# EAGLE design PARKPCB (EAGLE 9.3.0)
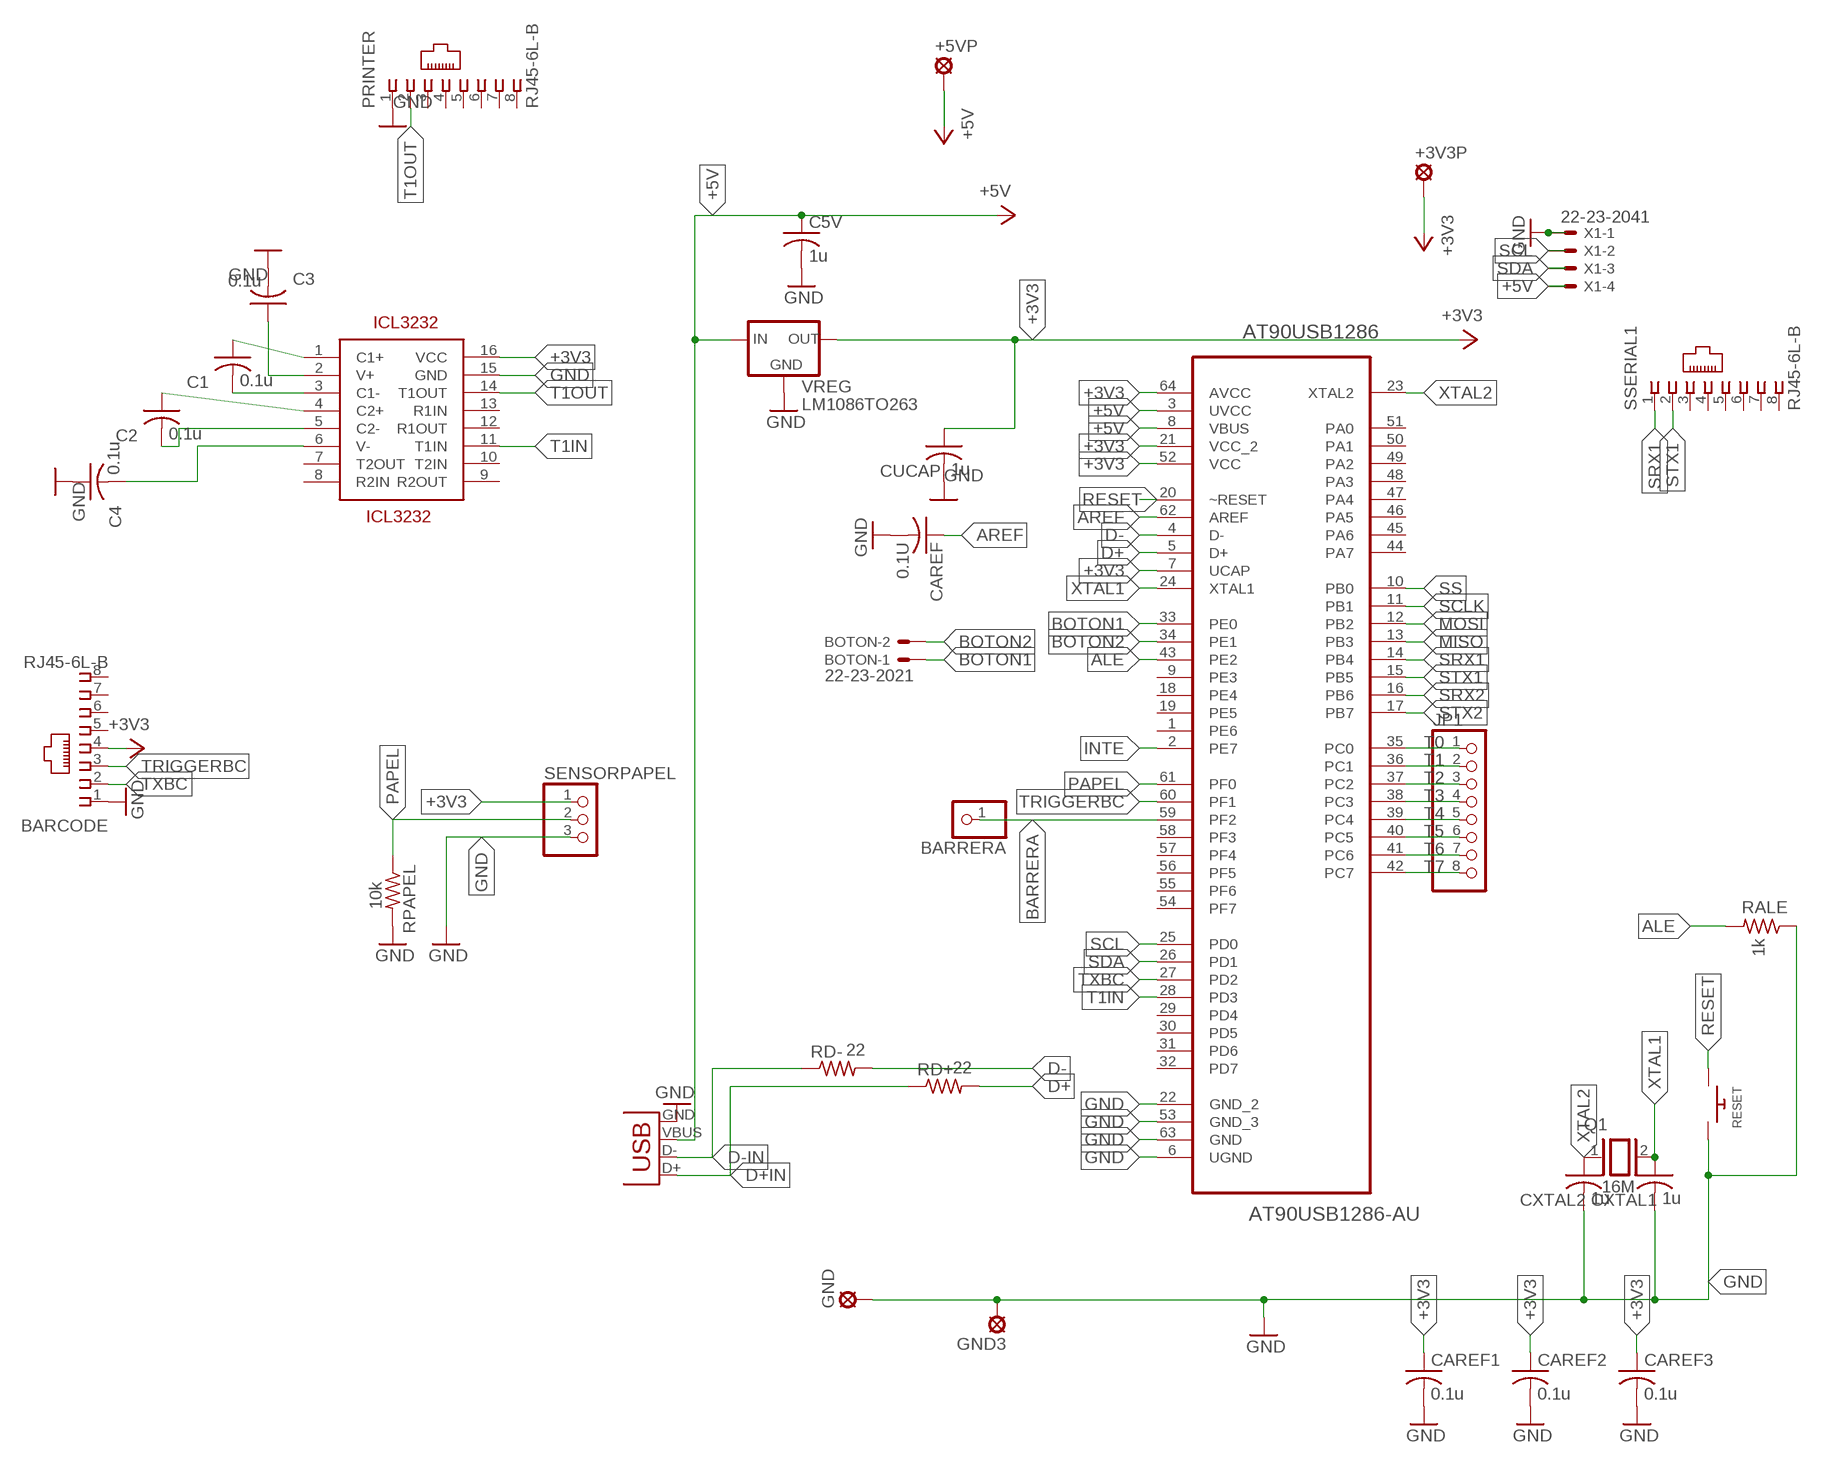
[diagram p0: schematic, sheet 1, part 1 of 2]
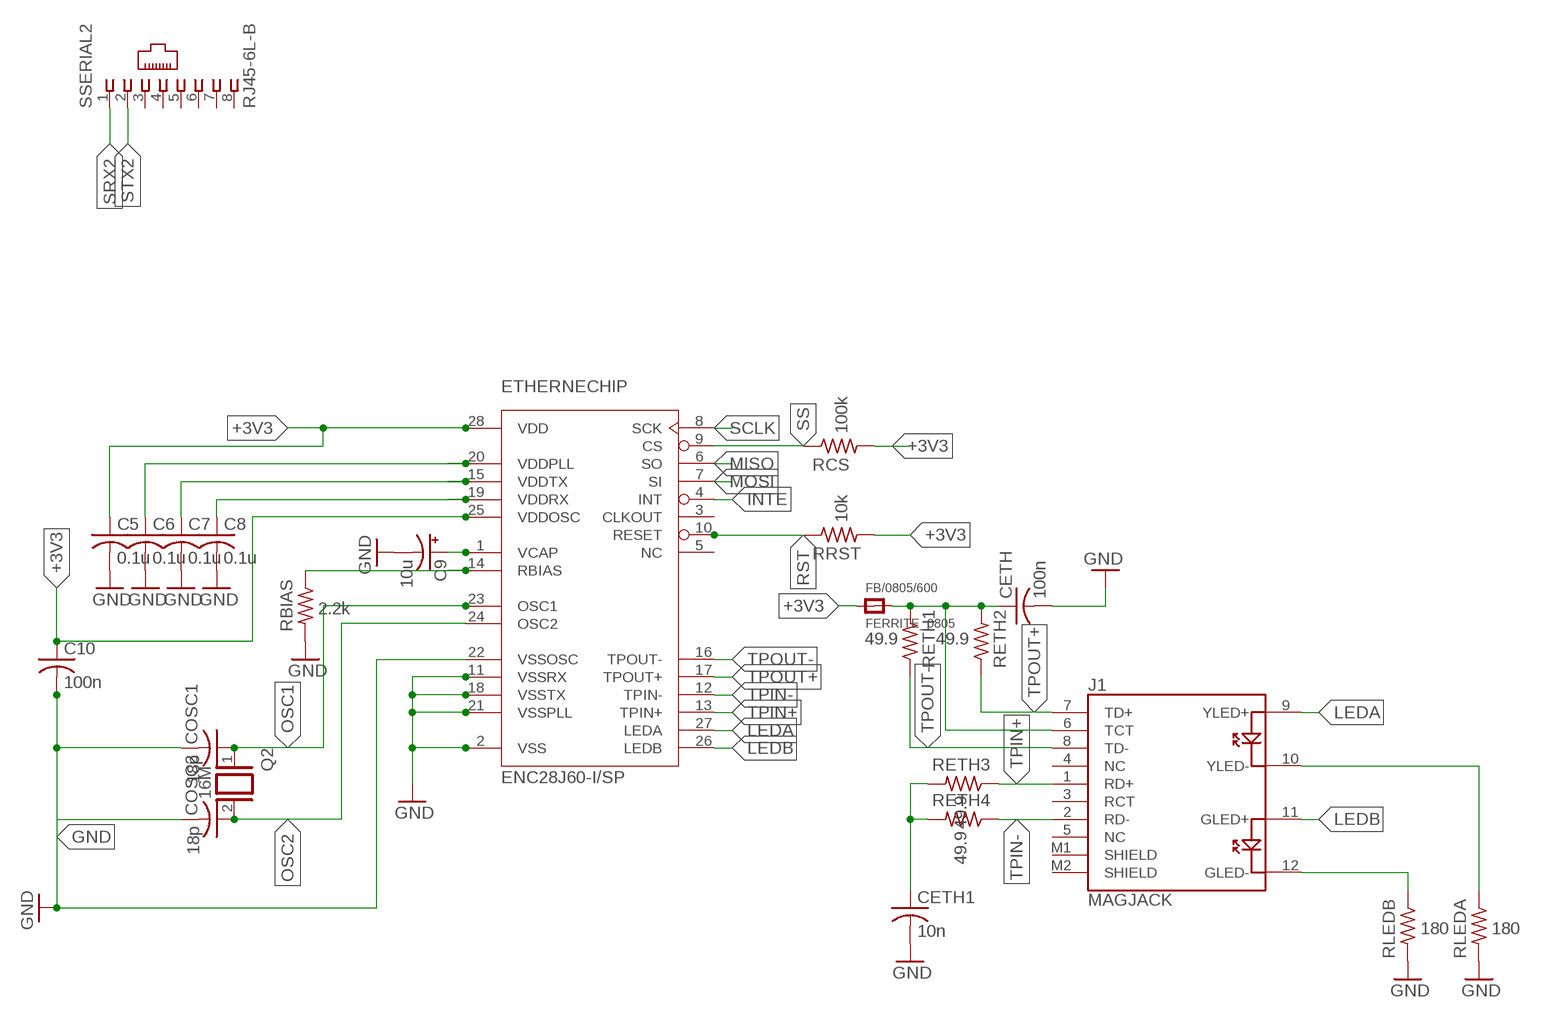
[diagram p1: schematic, sheet 1, part 2 of 2]

## Parts
+3V3P  LSP10  [LSP10]
+5VP  LSP10  [LSP10]
AT90USB1286  AT90USB1286-AU  [QFP80P1600X1600X120-64N]
BARCODE  RJ45-6L-B  [RJ45-NO-SHIELD]
BARRERA  PINHD-1X1  [1X01]
BOTON  22-23-2021  [22-23-2021]
C1  0.1u  C-US050-030X075  [C050-030X075]
C2  0.1u  C-US050-030X075  [C050-030X075]
C3  0.1u  C-US050-030X075  [C050-030X075]
C4  0.1u  C-US050-030X075  [C050-030X075]
C5  0.1u  C-US050-030X075  [C050-030X075]
C5V  1u  C-US050-030X075  [C050-030X075]
C6  0.1u  C-US050-030X075  [C050-030X075]
C7  0.1u  C-US050-030X075  [C050-030X075]
C8  0.1u  C-US050-030X075  [C050-030X075]
C9  10u  CPOL-USB45181B  [B45181B]
C10  100n  C-US050-030X075  [C050-030X075]
CAREF  0.1U  C-US050-030X075  [C050-030X075]
CAREF1  0.1u  C-US050-030X075  [C050-030X075]
CAREF2  0.1u  C-US050-030X075  [C050-030X075]
CAREF3  0.1u  C-US050-030X075  [C050-030X075]
CETH  100n  C-US050-030X075  [C050-030X075]
CETH1  10n  C-US050-030X075  [C050-030X075]
COSC1  18p  C-US050-030X075  [C050-030X075]
COSC2  18p  C-US050-030X075  [C050-030X075]
CUCAP  1u  C-US050-030X075  [C050-030X075]
CXTAL1  1u  C-US050-030X075  [C050-030X075]
CXTAL2  1u  C-US050-030X075  [C050-030X075]
ETHERNECHIP  ENC28J60-I/SP  [DIP28]
FB/0805/600  FERRITE_0805  [_0805]
GND  LSP10  [LSP10]
GND3  LSP10  [LSP10]
ICL3232  ICL3232  [DIL16]
J1  MAGJACK  [MAGJACK]
JP1  PINHD-1X8BIG  [1X08-BIG]
PRINTER  RJ45-6L-B  [RJ45-NO-SHIELD]
Q1  16M  XTAL/S  [QS]
Q2  16M  XTAL/S  [QS]
RALE  1k  R-US_0309/12  [0309/12]
RBIAS  2.2k  R-US_0309/12  [0309/12]
RCS  100k  R-US_0309/12  [0309/12]
RD+  22  R-US_0309/12  [0309/12]
RD-  22  R-US_0309/12  [0309/12]
RESET  SWITCH_PUSHBUTTONC&K_KSS  [BTN_CK_KSS]
RETH1  49.9  R-US_0309/12  [0309/12]
RETH2  49.9  R-US_0309/12  [0309/12]
RETH3  49.9  R-US_0309/12  [0309/12]
RETH4  49.9  R-US_0309/12  [0309/12]
RLEDA  180  R-US_0309/12  [0309/12]
RLEDB  180  R-US_0309/12  [0309/12]
RPAPEL  10k  R-US_0309/12  [0309/12]
RRST  10k  R-US_0309/12  [0309/12]
SENSORPAPEL  PINHD-1X3  [1X03]
SSERIAL1  RJ45-6L-B  [RJ45-NO-SHIELD]
SSERIAL2  RJ45-6L-B  [RJ45-NO-SHIELD]
USB  USB-MB-S  [USB-MB-S]
VREG  LM1086TO263  [TO263]
X1  22-23-2041  [22-23-2041]

## Nets
+3V3: +3V3P.MP AT90USB1286.7(UCAP) AT90USB1286.21(VCC_2) AT90USB1286.52(VCC) AT90USB1286.64(AVCC) BARCODE.4 C5.1 C10.1 CAREF1.1 CAREF2.1 CAREF3.1 CUCAP.1 ETHERNECHIP.25(VDDOSC) ETHERNECHIP.28(VDD) FB/0805/600.1 ICL3232.16(VCC) RCS.2 RRST.2 SENSORPAPEL.1 VREG.2(OUT)
+5V: +5VP.MP AT90USB1286.3(UVCC) AT90USB1286.8(VBUS) C5V.1 USB.VBUS VREG.3(IN) X1.4
ALE: AT90USB1286.43(PE2) RALE.2
AREF: AT90USB1286.62(AREF) CAREF.1
BARRERA: AT90USB1286.59(PF2) BARRERA.1
BOTON1: AT90USB1286.33(PE0) BOTON.1
BOTON2: AT90USB1286.34(PE1) BOTON.2
D+: AT90USB1286.5(D+) RD+.2
D+IN: RD+.1 USB.D+
D-: AT90USB1286.4(D-) RD-.2
D-IN: RD-.1 USB.D-
GND: AT90USB1286.6(UGND) AT90USB1286.22(GND_2) AT90USB1286.53(GND_3) AT90USB1286.63(GND) BARCODE.1 C3.2 C4.1 C5.2 C5V.2 C6.2 C7.2 C8.2 C9.- C10.2 CAREF1.2 CAREF2.2 CAREF3.2 CAREF.2 CETH1.2 CETH.2 COSC1.2 COSC2.2 CUCAP.2 CXTAL1.2 CXTAL2.2 ETHERNECHIP.2(VSS) ETHERNECHIP.11(VSSRX) ETHERNECHIP.18(VSSTX) ETHERNECHIP.21(VSSPLL) ETHERNECHIP.22(VSSOSC) GND3.MP GND.MP ICL3232.15(GND) PRINTER.1 RALE.1 RBIAS.2 RESET.P$2 RLEDA.2 RLEDB.2 RPAPEL.2 SENSORPAPEL.3 USB.GND VREG.1(GND) X1.1
INTE: AT90USB1286.2(PE7) ETHERNECHIP.4(INT)
LEDA: ETHERNECHIP.27(LEDA) J1.9(YLED+)
LEDB: ETHERNECHIP.26(LEDB) J1.11(GLED+)
MISO: AT90USB1286.13(PB3) ETHERNECHIP.6(SO)
MOSI: AT90USB1286.12(PB2) ETHERNECHIP.7(SI)
N$1: CETH.1 FB/0805/600.2 J1.6(TCT) RETH1.2 RETH2.2
N$2: C6.1 ETHERNECHIP.20(VDDPLL)
N$3: C7.1 ETHERNECHIP.15(VDDTX)
N$4: C8.1 ETHERNECHIP.19(VDDRX)
N$5: CETH1.1 RETH3.2 RETH4.2
N$6: C9.+ ETHERNECHIP.1(VCAP)
N$7: ETHERNECHIP.14(RBIAS) RBIAS.1
N$14: J1.12(GLED-) RLEDB.1
N$15: J1.10(YLED-) RLEDA.1
N$20: C1.1 ICL3232.1(C1+)
N$21: C3.1 ICL3232.2(V+)
N$22: C1.2 ICL3232.3(C1-)
N$23: C2.1 ICL3232.4(C2+)
N$24: C2.2 ICL3232.5(C2-)
N$25: C4.2 ICL3232.6(V-)
OSC1: COSC1.1 ETHERNECHIP.23(OSC1) Q2.1
OSC2: COSC2.1 ETHERNECHIP.24(OSC2) Q2.2
PAPEL: AT90USB1286.61(PF0) RPAPEL.1 SENSORPAPEL.2
RESET: AT90USB1286.20(~RESET) RESET.P$1
RST: ETHERNECHIP.10(RESET) RRST.1
SCL: AT90USB1286.25(PD0) X1.2
SCLK: AT90USB1286.11(PB1) ETHERNECHIP.8(SCK)
SDA: AT90USB1286.26(PD1) X1.3
SRX1: AT90USB1286.14(PB4) SSERIAL1.1
SRX2: AT90USB1286.16(PB6) SSERIAL2.1
SS: AT90USB1286.10(PB0) ETHERNECHIP.9(CS) RCS.1
STX1: AT90USB1286.15(PB5) SSERIAL1.2
STX2: AT90USB1286.17(PB7) SSERIAL2.2
T0: AT90USB1286.35(PC0) JP1.1
T1: AT90USB1286.36(PC1) JP1.2
T1IN: AT90USB1286.28(PD3) ICL3232.11(T1IN)
T1OUT: ICL3232.14(T1OUT) PRINTER.2
T2: AT90USB1286.37(PC2) JP1.3
T3: AT90USB1286.38(PC3) JP1.4
T4: AT90USB1286.39(PC4) JP1.5
T5: AT90USB1286.40(PC5) JP1.6
T6: AT90USB1286.41(PC6) JP1.7
T7: AT90USB1286.42(PC7) JP1.8
TPIN+: ETHERNECHIP.13(TPIN+) J1.1(RD+) RETH3.1
TPIN-: ETHERNECHIP.12(TPIN-) J1.2(RD-) RETH4.1
TPOUT+: ETHERNECHIP.17(TPOUT+) J1.7(TD+) RETH2.1
TPOUT-: ETHERNECHIP.16(TPOUT-) J1.8(TD-) RETH1.1
TRIGGERBC: AT90USB1286.60(PF1) BARCODE.3
TXBC: AT90USB1286.27(PD2) BARCODE.2
XTAL1: AT90USB1286.24(XTAL1) CXTAL1.1 Q1.2
XTAL2: AT90USB1286.23(XTAL2) CXTAL2.1 Q1.1
Unconnected: AT90USB1286.1(PE6) AT90USB1286.9(PE3) AT90USB1286.18(PE4) AT90USB1286.19(PE5) AT90USB1286.29(PD4) AT90USB1286.30(PD5) AT90USB1286.31(PD6) AT90USB1286.32(PD7) AT90USB1286.44(PA7) AT90USB1286.45(PA6) AT90USB1286.46(PA5) AT90USB1286.47(PA4) AT90USB1286.48(PA3) AT90USB1286.49(PA2) AT90USB1286.50(PA1) AT90USB1286.51(PA0) AT90USB1286.54(PF7) AT90USB1286.55(PF6) AT90USB1286.56(PF5) AT90USB1286.57(PF4) AT90USB1286.58(PF3) BARCODE.5 BARCODE.6 BARCODE.7 BARCODE.8 ETHERNECHIP.3(CLKOUT) ETHERNECHIP.5(NC) ICL3232.7(T2OUT) ICL3232.8(R2IN) ICL3232.9(R2OUT) ICL3232.10(T2IN) ICL3232.12(R1OUT) ICL3232.13(R1IN) J1.3(RCT) J1.4(NC) J1.5(NC) J1.M1(SHIELD) J1.M2(SHIELD) PRINTER.3 PRINTER.4 PRINTER.5 PRINTER.6 PRINTER.7 PRINTER.8 SSERIAL1.3 SSERIAL1.4 SSERIAL1.5 SSERIAL1.6 SSERIAL1.7 SSERIAL1.8 SSERIAL2.3 SSERIAL2.4 SSERIAL2.5 SSERIAL2.6 SSERIAL2.7 SSERIAL2.8

## Library data of the parts
+3V3P +5VP GND GND3 = solpad:LSP10: SOLDER PAD drill 1.0 mm, distributor Buerklin, 12H555
AT90USB1286 = Atmel_By_element14_Batch_1-00:AT90USB1286-AU: MCU; DESCRIPTION: MCU; MPN: AT90USB1286-AU; OC_FARNELL: 1748495; OC_NEWARK: 26R5675; PACKAGE: QFP-64; SUPPLIER: Atmel
BARCODE PRINTER SSERIAL1 SSERIAL2 = con-tycoelectronics:RJ45: CORCOM Modular RJ Jacks No Shield Source: www.tycoelectronics.com .. ENG_DS_1654001_1099_RJ_L_0507.pdf; MPN: RJ45-6L-B; OC_FARNELL: unknown; OC_NEWARK: 16R6090
BARRERA = adafruit:PINHD-1X1: Pin header 1x1 for 0.1" spacing With round pins
BOTON = con-molex:22-23-2021: .100" (2.54mm) Center Header - 2 Pin; MF: MOLEX; MPN: 22-23-2021; OC_FARNELL: 1462926; OC_NEWARK: 25C3832
C1-C5 C5V C6-C8 C10 CAREF CAREF1-CAREF3 CETH CETH1 COSC1 COSC2 CUCAP CXTAL1 CXTAL2 = rcl:C-US: CAPACITOR, American symbol; SPICEPREFIX: C
C9 = rcl:CPOL-US: POLARIZED CAPACITOR, American symbol; SPICEPREFIX: C
ETHERNECHIP = microchip-ethernet:ENC28J60: Stand-Alone 10 Ethernet Controller with SPI interface The ENC28J60 is a stand-alone Ethernet controller with an industry standard Serial Peripheral Interface (SPI). It is designed to serve as an Ethernet network interface for any controller equipped with SPI. The ENC28J60 meets all of the IEEE 802.3 specifications. It incorporates a number of packet filtering schemes to limit incoming packets. It also provides an internal DMA module for fast data throughput and hardware assisted checksum calculation, which is used in various network protocols. Communication with the host controller is implemented via an interrupt pin and the SPI, with clock rates of up to 20 MHz. Two dedicated pins are used for LED link and network activity indication.
FB/0805/600 = audio amplifier example:FERRITE
ICL3232 = ICL3232:ICL3232: 3V to RS-232 transceiver; AVAILABILITY: Unavailable; MF: Intersil; MP: ICL3232; PACKAGE: None; PRICE: None
J1 = SparkFun-Connectors:MAGJACK: MAGJACK: RJ-45 with LEDs This is a single port, RJ45 ethernet jacks with built in transformer (magnetics), status LEDs, and shielding. Here is the connector we sell at SparkFun: RJ45 Ethernet MagJack-Compatible <https://www.sparkfun.com/products/8534> (PRT-08534) Datasheet <http://www.sparkfun.com/datasheets/Prototyping/MagJack.pdf> It is used on this SparkFun product: SparkFun RJ45 MagJack Breakout <https://www.sparkfun.com/products/13021> (BOB-13021); PROD_ID: CONN-09556; SF_ID: PRT-08534
JP1 = adafruit:PINHD-1X8: PIN HEADER
Q1 Q2 = special:XTAL/S: CRYSTAL
RALE RBIAS RCS RD+ RD- RETH1-RETH4 RLEDA RLEDB RPAPEL RRST = rcl:R-US_: RESISTOR, American symbol; SPICEPREFIX: R
RESET = adafruit:SWITCH_PUSHBUTTON: Buttons SOFTTOUCHSMD_SJ - Soft touch temporary push button (Super Junk Akihabara) Compatible with SKPMANE010 [Mouser: 688-SKPMAN] C&K_KSS = Digikey: KSS221GLFS
SENSORPAPEL = adafruit:PINHD-1X3: PIN HEADER
USB = con-usb:USB: USB Connectors
VREG = v-reg-2:LM1086
X1 = con-molex:22-23-2041: .100" (2.54mm) Center Header - 4 Pin; MF: MOLEX; MPN: 22-23-2041; OC_FARNELL: 1462920; OC_NEWARK: 38C0355

## Board
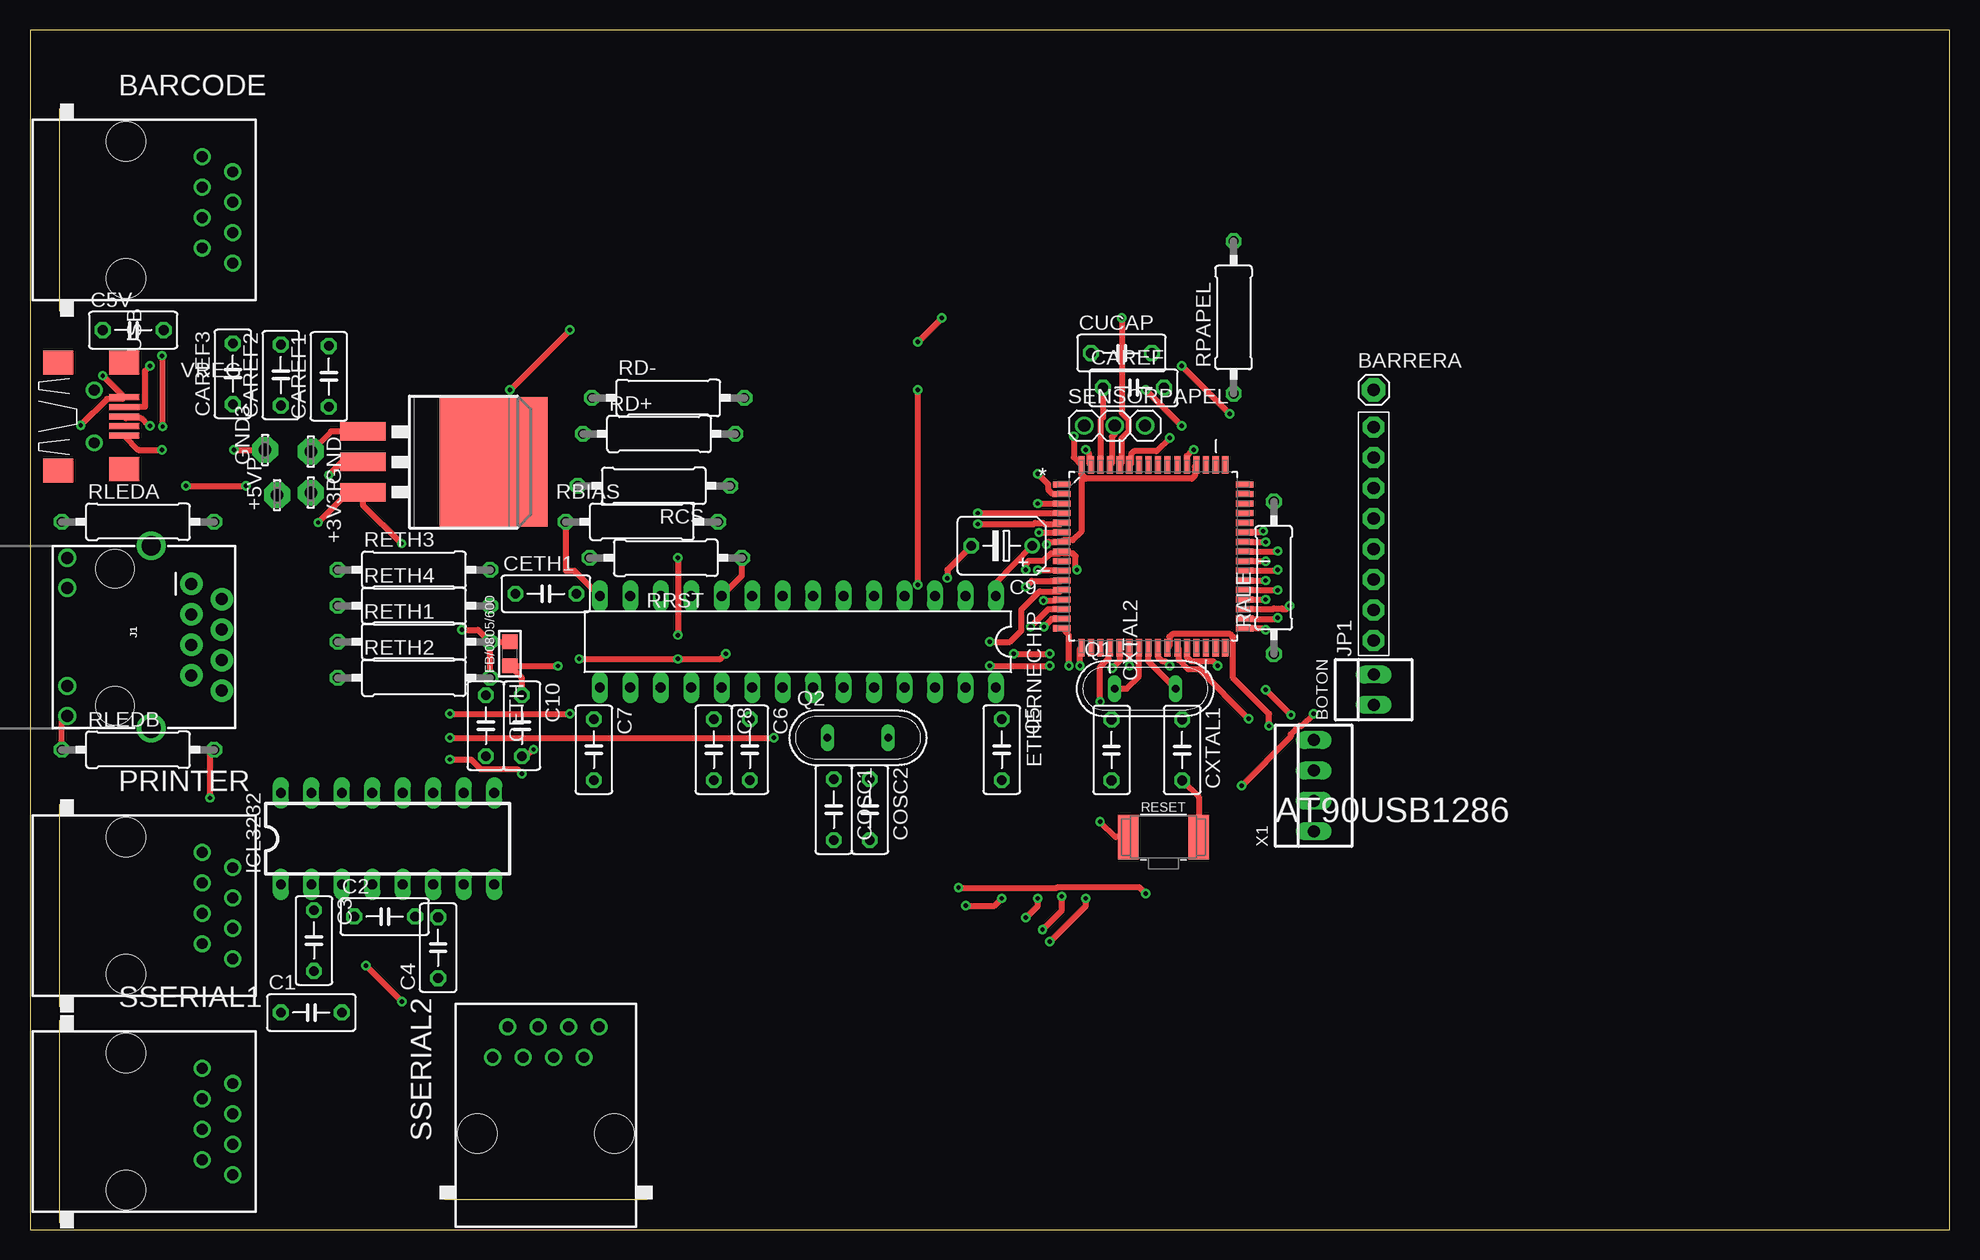
[diagram p2: board, top side]
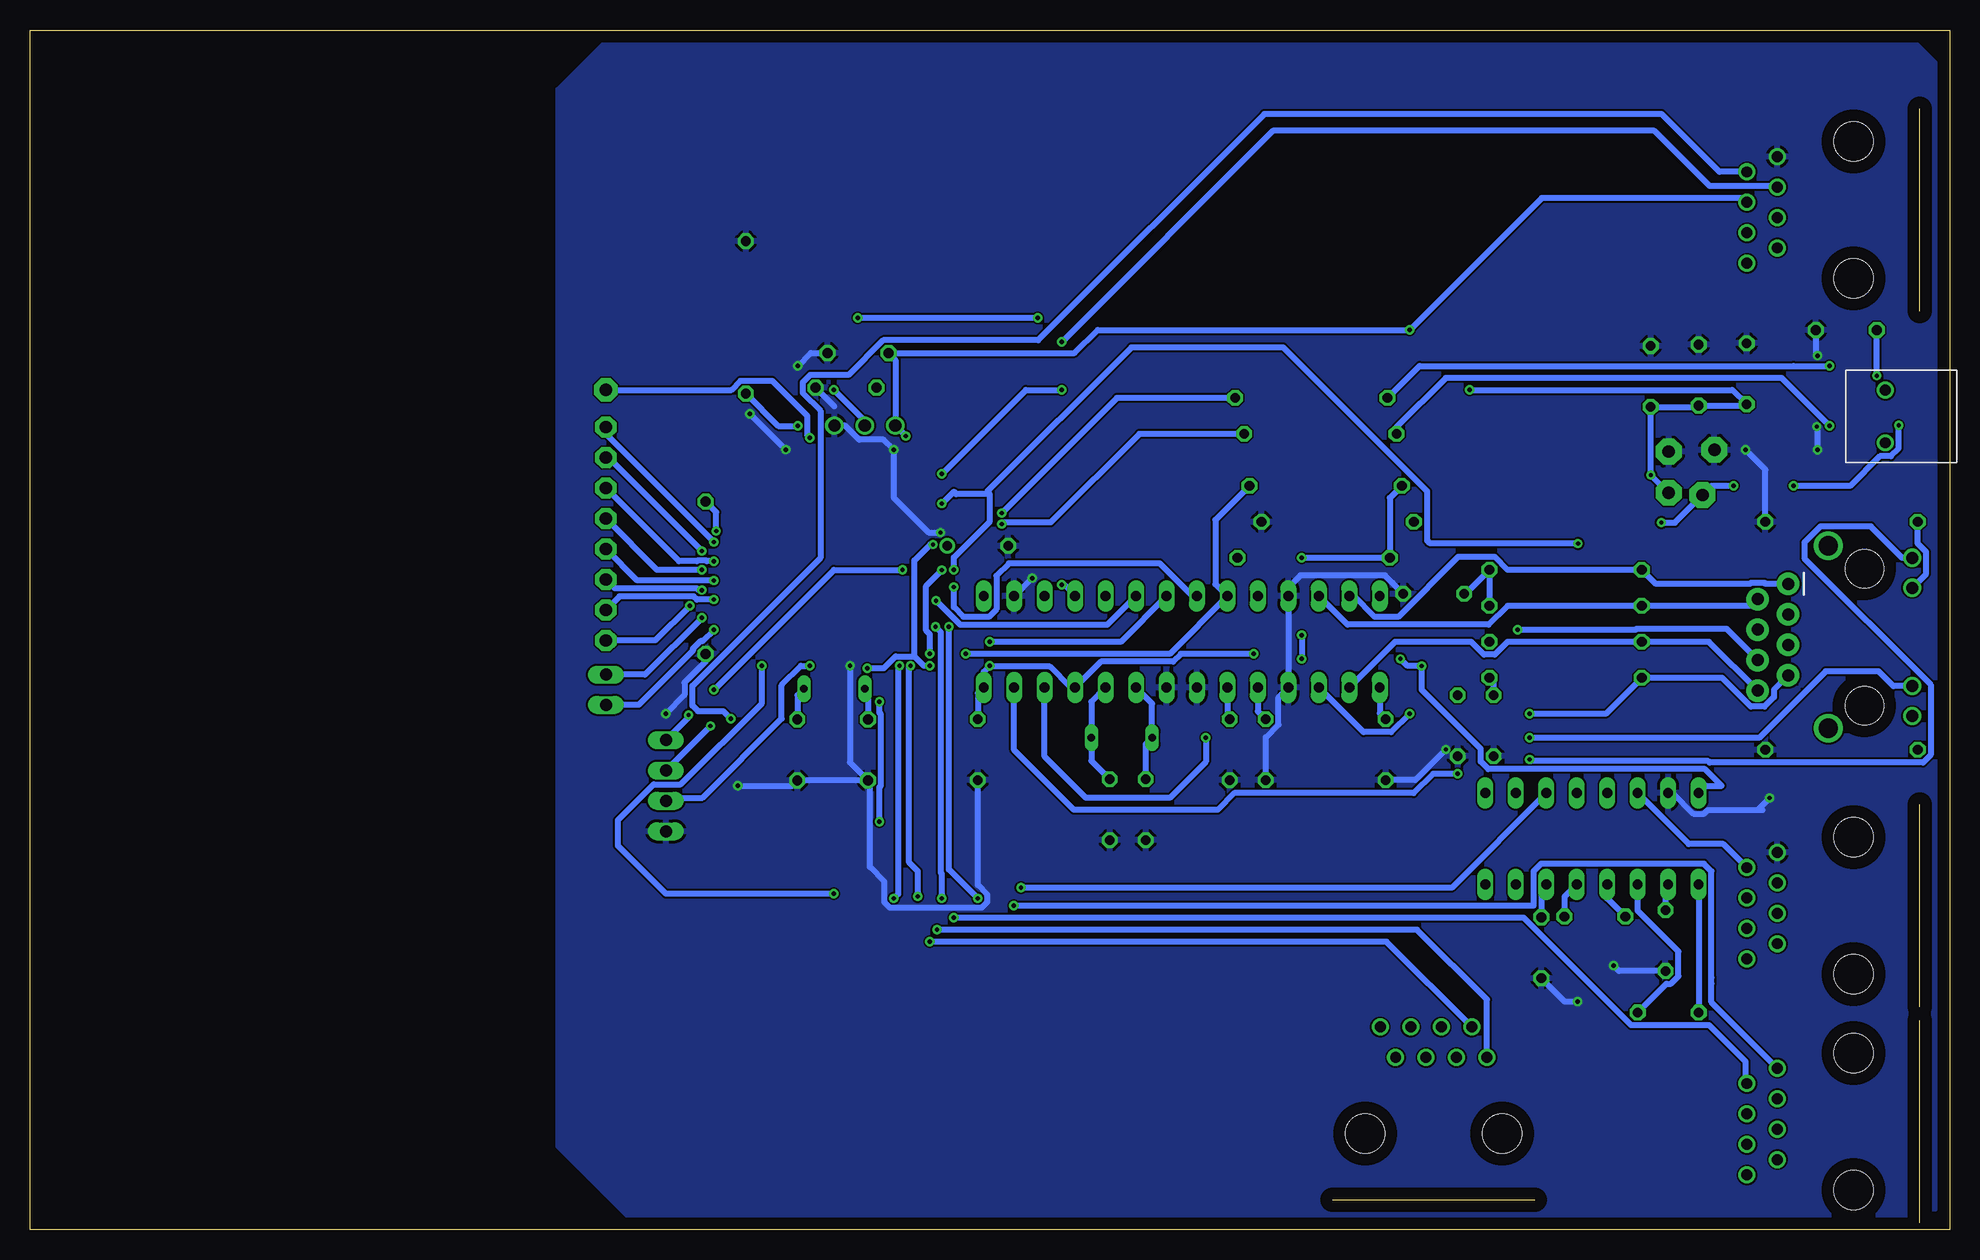
[diagram p3: board, bottom side, seen from below]

Size 160 x 100 mm. Coordinates in mm from the lower left corner, seen from the top.
Outline: 0,0 160,0 160,100 0,100 0,0
Copper layers (1*16): Top 0.035mm / dielectric 1.5mm / Bottom 0.035mm
Design rules "default *": minimum track width 6mil, minimum drill 0.35mm, track to track 6mil, track to pad 6mil, pad to pad 6mil, via to via 6mil, smd to smd 6mil, copper to edge 40mil, drill to drill 6mil, minimum pad ring 10mil, minimum via ring 8mil, stop-mask expansion 4mil, vias tented up to drill 0mil, thermal gap 10mil

### Footprints (pad centres in the part's own frame; a part is rotated, then mirrored left to right if it is on the bottom)
LSP10 = drill 1.016 pad 2.159 octagon: MP 0,0
QFP80P1600X1600X120-64N = smd 1.473 x 0.508: 1 -7.62,5.994; 2 -7.62,5.207; 3 -7.62,4.394; 4 -7.62,3.607; 5 -7.62,2.794; 6 -7.62,2.007; 7 -7.62,1.194; 8 -7.62,0.406; 9 -7.62,-0.406; 10 -7.62,-1.194; 11 -7.62,-2.007; 12 -7.62,-2.794; 13 -7.62,-3.607; 14 -7.62,-4.394; 15 -7.62,-5.207; 16 -7.62,-5.994; 33 7.62,-5.994; 34 7.62,-5.207; 35 7.62,-4.394; 36 7.62,-3.607; 37 7.62,-2.794; 38 7.62,-2.007; 39 7.62,-1.194; 40 7.62,-0.406; 41 7.62,0.406; 42 7.62,1.194; 43 7.62,2.007; 44 7.62,2.794; 45 7.62,3.607; 46 7.62,4.394; 47 7.62,5.207; 48 7.62,5.994 | smd 0.508 x 1.473: 17 -5.994,-7.62; 18 -5.207,-7.62; 19 -4.394,-7.62; 20 -3.607,-7.62; 21 -2.794,-7.62; 22 -2.007,-7.62; 23 -1.194,-7.62; 24 -0.406,-7.62; 25 0.406,-7.62; 26 1.194,-7.62; 27 2.007,-7.62; 28 2.794,-7.62; 29 3.607,-7.62; 30 4.394,-7.62; 31 5.207,-7.62; 32 5.994,-7.62; 49 5.994,7.62; 50 5.207,7.62; 51 4.394,7.62; 52 3.607,7.62; 53 2.794,7.62; 54 2.007,7.62; 55 1.194,7.62; 56 0.406,7.62; 57 -0.406,7.62; 58 -1.194,7.62; 59 -2.007,7.62; 60 -2.794,7.62; 61 -3.607,7.62; 62 -4.394,7.62; 63 -5.207,7.62; 64 -5.994,7.62
RJ45-NO-SHIELD = drill 0.9 pad 1.4: 1 -4.445,6.35; 2 -3.175,8.89; 3 -1.905,6.35; 4 -0.635,8.89; 5 0.635,6.35; 6 1.905,8.89; 7 3.175,6.35; 8 4.445,8.89 | hole 3.251: -5.715,0; 5.715,0
1X01 = drill 1.016 pad 1.93 octagon: 1 0,0
22-23-2021 = drill 1 long: 1 -1.27,0; 2 1.27,0
C050-030X075 = drill 0.813 octagon: 1 -2.54,0; 2 2.54,0
B45181B = drill 0.813: + -2.54,0 | drill 0.813 octagon: - 2.54,0
DIP28 = drill 0.813 long: 1 -16.51,-3.81; 2 -13.97,-3.81; 3 -11.43,-3.81; 4 -8.89,-3.81; 5 -6.35,-3.81; 6 -3.81,-3.81; 7 -1.27,-3.81; 8 1.27,-3.81; 9 3.81,-3.81; 10 6.35,-3.81; 11 8.89,-3.81; 12 11.43,-3.81; 13 13.97,-3.81; 14 16.51,-3.81; 15 16.51,3.81; 16 13.97,3.81; 17 11.43,3.81; 18 8.89,3.81; 19 6.35,3.81; 20 3.81,3.81; 21 1.27,3.81; 22 -1.27,3.81; 23 -3.81,3.81; 24 -6.35,3.81; 25 -8.89,3.81; 26 -11.43,3.81; 27 -13.97,3.81; 28 -16.51,3.81
_0805 = smd 1.2 x 1.3: 1 -1.016,0; 2 1.016,0
DIL16 = drill 0.813 long: 1 -8.89,-3.81; 2 -6.35,-3.81; 3 -3.81,-3.81; 4 -1.27,-3.81; 5 1.27,-3.81; 6 3.81,-3.81; 7 6.35,-3.81; 8 8.89,-3.81; 9 8.89,3.81; 10 6.35,3.81; 11 3.81,3.81; 12 1.27,3.81; 13 -1.27,3.81; 14 -3.81,3.81; 15 -6.35,3.81; 16 -8.89,3.81
MAGJACK = drill 1 pad 1.88: 1 3.175,17.445; 2 4.445,19.985; 3 5.715,17.445; 4 6.985,19.985; 5 8.255,17.445; 6 9.525,19.985; 7 10.795,17.445; 8 12.065,19.985 | drill 1 pad 1.27: 9 1,7.1; 10 3.5,7.1; 11 11.7,7.1; 12 14.2,7.1 | drill 1.6 pad 2.184: M1 0,14.1; M2 15.2,14.1 | hole 3.2: 1.905,11.095; 13.335,11.095
1X08-BIG = drill 1.016 pad 1.778 octagon: 1 -8.89,0; 2 -6.35,0; 3 -3.81,0; 4 -1.27,0; 5 1.27,0; 6 3.81,0; 7 6.35,0; 8 8.89,0
QS = drill 0.61 long: 1 -2.54,0; 2 2.54,0
0309/12 = drill 0.813 octagon: 1 -6.35,0; 2 6.35,0
BTN_CK_KSS = smd 1.7 x 3.7: P$1 -2.95,0; P$2 2.95,0
1X03 = drill 1.016: 1 -2.54,0; 2 0,0; 3 2.54,0
USB-MB-S = smd 2.5 x 0.5: D+ 2.5,0; D- 2.5,0.8; GND 2.5,-1.6; ID 2.5,-0.8; VBUS 2.5,1.6 | smd 2.5 x 2: P$1 -3,-4.5; P$2 -3,4.5; P$3 2.5,-4.4; P$4 2.5,4.5 | drill 0.9: P$5 0,2.2; P$6 0,-2.2
TO263 = smd 1.524 x 3.81: 1 -2.54,-8.255; 2 0,-8.255; 3 2.54,-8.255 | smd 10.8 x 9: 4 0,2.635
22-23-2041 = drill 1 long: 1 -3.81,0; 2 -1.27,0; 3 1.27,0; 4 3.81,0

### Placement (x,y rotation side)
+3V3P  23.41,61.42 270 top
+5VP  20.59,61.23 90 top
AT90USB1286  93.63,56.12 0 top
BARCODE  8,85 270 top
BARRERA  112,70 0 top
BOTON  112,45 90 top
C1  23.45,18.09 0 top
C2  29.56,26.09 0 top
C3  23.67,24.09 270 top
C4  34.02,23.49 90 top
C5  81,40 270 top
C5V  8.6,74.98 0 top
C6  60,40 270 top
C7  47,40 270 top
C8  57,40 270 top
C9  81,57 180 top
C10  41,42 270 top
CAREF  91.98,70.18 0 top
CAREF1  24.91,71.12 90 top
CAREF2  20.91,71.23 90 top
CAREF3  16.91,71.34 90 top
CETH  38,42 270 top
CETH1  43,53 0 top
COSC1  67,35 270 top
COSC2  70,35 270 top
CUCAP  90.98,73.07 0 top
CXTAL1  96.04,39.98 270 top
CXTAL2  90.15,39.98 270 top
ETHERNECHIP  64,49 180 top
FB/0805/600  40,48 90 top
GND  23.41,64.85 270 top
GND3  19.59,65 90 top
ICL3232  29.8,32.58 0 top
J1  -4,57 270 top
JP1  112,58 90 top
PRINTER  8,27 270 top
Q1  92.95,45.09 0 top
Q2  69,41 0 top
RALE  103.68,54.33 90 top
RBIAS  51,59 0 top
RCS  52,62 180 top
RD+  52.44,66.33 0 top
RD-  53.2,69.33 0 top
RESET  94.48,32.71 0 top
RETH1  32,49 0 top
RETH2  32,46 0 top
RETH3  32,55 0 top
RETH4  32,52 0 top
RLEDA  9,59 0 top
RLEDB  9,40 0 top
RPAPEL  100.33,76.04 90 top
RRST  53,56 180 top
SENSORPAPEL  90.41,67.02 0 top
SSERIAL1  8,9 270 top
SSERIAL2  43,8 0 top
USB  5.35,67.78 0 top
VREG  36,64 270 top
X1  107,37 90 top

### Tracks (layer width: path | path; a pad name or v marks a point on that pad's centre or on a via)
+3V3  (via drill 0.35)
  Top 0.508: C10.1 41,45.98 FB/0805/600.1 v44,46.98 | v45.77,47.58 v54,47.58 57.58,47.58 v58,48 | VREG.2 25.99,64 v24.9,62.91 | v40,70 v45,75 | v54,56 v54,49.55 | v87,66.15 87,64.38 AT90USB1286.64 | v80,47 v85,47 | AT90USB1286.52 97.08,63.59 97.08,62.84 96.85,62.6 88,62.6 87.64,62.96 AT90USB1286.64 | AT90USB1286.64 87.64,58.19 86.92,57.47 86.16,57.47 AT90USB1286.7 84.94,57.31 v84.73,57.11 | AT90USB1286.21 90.84,47.73 90.82,47.72 90.82,47.41 v90.2,46.8
  Bottom 0.508: v45.77,47.58 45.18,46.98 v44,46.98 44,45 39.07,40.07 39.07,39.02 38.44,38.39 20.39,38.39 19,37 20.3,37 ICL3232.16 | v54,49.55 v54,47.58 | v87,66.15 SENSORPAPEL.1 87.87,72.5 CUCAP.1 72.93,73.07 71,75 v45,75 34,86 17.25,86 BARCODE.4 | +3V3P.MP v24.9,62.91 v24.91,62.92 CAREF1.1 21.02,68.58 CAREF2.1 17.02,68.69 CAREF3.1 18.11,70 v40,70 | RCS.2 46.65,61 RRST.2 v54,56 | v58,48 64.07,48 64.73,47.34 70.74,47.34 ETHERNECHIP.25 73.26,45.19 74.99,46.92 79.92,46.92 v80,47 80.51,46.49 ETHERNECHIP.28 81,44.7 C5.1 | v85,47 85.49,47 86.28,47.78 | 86.28,47.78 86.28,55.78 84.95,57.11 v84.73,57.11 | v90.2,46.8 88.83,46.8 87.84,47.78 86.28,47.78
+5V  (via drill 0.35)
  Top 0.508: v83,55 83,55.5 83.25,55.76 84.49,55.76 85.11,56.37 85.86,56.37 AT90USB1286.8 86.16,56.37 86.92,56.37 87.15,56.14 87.15,55.12 v87.28,55 | v84,60.51 AT90USB1286.3 | v6.06,71.17 USB.VBUS 7.71,69.24 6.43,69.24 v4.24,67.04 | v24.02,58.93 26.55,61.46 VREG.3 27.75,60.41 v30.97,57.19 | v13,62 v18,62 | v105.11,42.89 v103,45
  Bottom 0.508: v84,60.51 83,61.51 82.78,61.3 80,61.3 | v83,55 83,56.03 80,59.03 80,61.3 | v6.06,71.17 C5V.1 | v4.24,67.04 4.24,65.12 4.89,64.47 5.81,64.47 8.28,62 v13,62 | v24.02,58.93 22.89,58.93 +5VP.MP 19.82,62 v18,62 | v30.97,57.19 43.3,57.19 43.54,57.43 43.54,61.54 55.54,73.54 68.19,73.54 80.22,61.51 80,61.3 | X1.4 105.11,42.7 v105.11,42.89 | v103,45 93,55 v87.28,55
ALE  (via drill 0.35)
  Top 0.508: AT90USB1286.43 102.71,58.13 v102.8,58.22
  Bottom 0.508: v102.8,58.22 102.8,59.8 RALE.2
AREF
  Top 0.508: CAREF.1 89.44,67.7 89.24,67.5 AT90USB1286.62
BARRERA  (via drill 0.35)
  Top 0.508: v95,66 93.88,64.88 92.01,64.88 91.78,64.64 91.78,63.89 AT90USB1286.59
  Bottom 0.508: BARRERA.1 101.53,70 100.77,70.76 98.13,70.76 95.22,67.84 95.22,66.22 v95,66
BOTON1  (via drill 0.35)
  Top 0.508: AT90USB1286.33 102.87,50.13 v103,50
  Bottom 0.508: BOTON.1 109.27,43.73 104.75,48.25 104.75,48.42 104.12,49.05 103.95,49.05 v103,50
BOTON2  (via drill 0.35)
  Top 0.508: AT90USB1286.34 103.91,50.91 v104,51
  Bottom 0.508: v104,51 108.73,46.27 BOTON.2
D+  (via drill 0.35)
  Top 0.508: AT90USB1286.5 85.92,58.82 84.51,58.82 84.44,58.9 83.79,58.9 83.71,58.82 v79,58.82
  Bottom 0.508: RD+.2 67.53,66.33 74.92,58.95 78.88,58.95 v79,58.82
D+IN  (via drill 0.35)
  Top 0.508: USB.D+ 7.99,67.64 9.27,67.64 9.9,67 v10,67
  Bottom 0.508: v10,67 14,71 42,71 46.09,66.91 RD+.1
D-  (via drill 0.35)
  Top 0.508: v79,59.73 AT90USB1286.4
  Bottom 0.508: RD-.2 69.4,69.33 v79,59.73
D-IN  (via drill 0.35)
  Top 0.508: USB.D- 9.58,68.58 9.58,71.58 v10,72
  Bottom 0.508: RD-.1 44.18,72 13,72 v10,72
GND  (via drill 0.35)
  Top 0.508: C10.2 41.4,39.46 v41.97,40.03 | AT90USB1286.63 88.3,63.87 88.3,64.64 88,64.94 v88,65.01 | v84.11,58.11 85.87,58.11 85.89,58.13 AT90USB1286.6 | C9.- 76.46,55 v76.46,54.3 | v17,65 GND3.MP | USB.GND 9.03,65 v11,65 | v11.05,66.94 11.05,72.78 v11,72.84 | v15,35.98 15,39.65 RLEDB.2 | CXTAL1.2 97.43,36.05 RESET.P$2 | v28,22 v31,19 | v107,43 105.97,41.97 105.77,41.97 105.09,41.29 105.09,41.09 v101,37 | v97,65.01 96.88,64.88 96.81,64.88 96.42,64.49 AT90USB1286.53 | v100,68 v96,72 | VREG.1 25.1,66.54 GND.MP | AT90USB1286.22 91.62,47.03 v91.65,47
  Bottom 0.508: v41.97,40.03 44.53,37.46 C7.2 | CAREF.2 92.95,68.61 | CXTAL2.2 90,37.29 90,30.21 88.78,29 88.78,27.28 88.33,26.82 80.67,26.82 80.22,27.28 80.22,27.93 81,28.71 C5.2 | v84.11,58.11 85.11,58.11 88,61 v88,65.01 88.84,65.85 90.89,65.85 92.06,67.02 SENSORPAPEL.3 | ETHERNECHIP.2 77.95,52.81 v76.46,54.3 | C8.2 57,41.03 55.93,42.1 55.93,44.37 ETHERNECHIP.18 ETHERNECHIP.11 54.78,53.13 54.78,53.87 54.12,54.54 47.05,54.54 46.42,53.91 46.42,53.88 CETH1.2 | C5V.2 11.14,72.98 v11,72.84 | RLEDA.2 15.35,63.35 v17,65 | ICL3232.15 23.08,36.39 21.35,34.66 20.47,34.66 20.15,34.98 16,34.98 | 16,34.98 15.58,34.98 | v11,65 11,66.89 v11.05,66.94 | 16,34.98 v15,35.98 | CXTAL2.2 96,37.44 | 96,37.44 CXTAL1.2 | C3.2 27.55,21.55 v28,22 | v31,19 32.07,19 C4.1 | RALE.1 103.68,47.36 105.44,45.6 105.44,44.55 v107,43 | v101,37 96.44,37 96,37.44 | v97,65.01 v97.01,65.01 v100,68 | v96,72 94.93,73.07 CUCAP.2 | v91.65,47 91.65,38.94 CXTAL2.2
  pour Bottom: 1,2 1,97 4,100 111,100 116,95 116,7 109,0 3,0
INTE  (via drill 0.35)
  Top 0.508: v74,53.75 v74,70 | v84,63 84.87,62.13 84.87,61.69 85.23,61.33 AT90USB1286.2
  Bottom 0.508: ETHERNECHIP.4 73.83,53.75 v74,53.75 | v84,63 77,70 v74,70
LEDA  (via drill 0.35)
  Top 0.508: v41,38 40.61,38.39 37.56,38.39 36.77,39.18 v35,39.18
  Bottom 0.508: J1.9 3.94,56 6.55,58.61 10.77,58.61 12.1,57.27 12.1,55.94 1.58,45.42 1.58,39.56 2.21,38.93 20,38.93 20.12,39.05 34.88,39.05 v35,39.18 | v41,38 43.06,38 44.67,36.39 59.61,36.39 61,35 73,35 77.97,39.97 ETHERNECHIP.27
LEDB  (via drill 0.35)
  Top 0.508: v35,41 v62,41
  Bottom 0.508: v35,41 15.86,41 10.32,46.53 5.91,46.53 4.67,45.3 J1.11 | v62,41 62,39 65,36 72,36 75.43,39.43 ETHERNECHIP.26
MISO  (via drill 0.35)
  Top 0.508: AT90USB1286.13 85.57,52.51 85.47,52.42 v84.47,52.42
  Bottom 0.508: v84.47,52.42 82.47,50.42 70.2,50.42 ETHERNECHIP.6
MOSI  (via drill 0.35)
  Top 0.508: v80,49 81.68,49 82.63,49.94 82.63,51.68 83.97,53.03 84.15,53.21 85.89,53.21 AT90USB1286.12
  Bottom 0.508: ETHERNECHIP.7 69.08,49 v80,49
N$1  (via drill 0.35)
  Top 0.508: FB/0805/600.2 39.98,49 RETH1.2 | v36,50 37.35,50 RETH1.2 | RETH2.2 RETH1.2
  Bottom 0.508: v36,50 26.16,50 26.09,50.07 18.58,50.07 J1.6 | CETH.1 38,45.65 RETH2.2
N$2
  Bottom 0.508: ETHERNECHIP.20 60.19,42.73 C6.1
N$3
  Bottom 0.508: ETHERNECHIP.15 47.49,43.03 C7.1
N$4
  Bottom 0.508: ETHERNECHIP.19 57.65,43.19 C8.1
N$5
  Bottom 0.508: RETH4.2 RETH3.2 40.35,53 CETH1.1
N$6
  Top 0.508: C9.+ 80.51,53.89 ETHERNECHIP.1
N$7
  Top 0.508: ETHERNECHIP.14 45.37,54.93 44.65,54.93 RBIAS.1
N$14
  Top 0.508: RLEDB.1 2.65,42.35 J1.12
N$15
  Bottom 0.508: RLEDA.1 2.65,57.19 1.94,56.48 1.94,54.66 J1.10
N$20
  Bottom 0.508: ICL3232.1 C1.1
N$21
  Bottom 0.508: ICL3232.2 23.67,28.55 C3.1
N$22
  Bottom 0.508: ICL3232.3 25.99,26.57 22.6,23.18 22.6,21.11 23.23,20.48 23.6,20.48 C1.2
N$23
  Bottom 0.508: ICL3232.4 28.53,27.6 C2.1
N$24
  Bottom 0.508: ICL3232.5 32.1,27.74 C2.2
N$25
  Bottom 0.508: ICL3232.6 34.02,28.36 C4.2
OSC1
  Bottom 0.508: COSC1.1 67,40.46 Q2.1 66.46,43.84 ETHERNECHIP.23
OSC2
  Bottom 0.508: ETHERNECHIP.24 71.54,44 Q2.2 71.54,39.08 COSC2.1
PAPEL  (via drill 0.35)
  Top 0.508: v96,67 v93,70 | SENSORPAPEL.2 90.41,66.3 90.18,66.07 90.18,63.89 AT90USB1286.61
  Bottom 0.508: RPAPEL.1 97.64,67 v96,67 | v93,70 90.41,67.41 SENSORPAPEL.2
RESET  (via drill 0.35)
  Top 0.508: RESET.P$1 90.5,32.71 v89.2,34 | AT90USB1286.20 89.9,48.37 89.9,47.59 89.2,46.9 v89.2,44
  Bottom 0.508: v89.2,34 89.2,36.88 89.08,37 89.08,42.96 89.2,43.08 v89.2,44
RST
  Top 0.508: ETHERNECHIP.10 59.35,54.51 RRST.1
SCL  (via drill 0.35)
  Top 0.508: v95,47 94.64,47.36 94.4,47.36 94.04,47.72 AT90USB1286.25
  Bottom 0.508: v95,47 95.73,47 97.34,45.39 97.34,42.6 103.94,36 106.73,36 X1.2
SCLK  (via drill 0.35)
  Top 0.508: AT90USB1286.11 85.96,54.07 85.79,54.07 85.78,54.08 85.13,54.08 85.11,54.07 83.51,54.07 v83,53.55
  Bottom 0.508: ETHERNECHIP.8 63.1,52.81 65.83,55.54 78.41,55.54 79.44,54.51 79.44,51.71 80.07,51.08 82.2,51.08 83,51.88 v83,53.55
SDA  (via drill 0.35)
  Top 0.508: v103.28,41.98 103.28,42.98 100.28,45.98 100.28,49.41 100.05,49.64 95.21,49.64 94.98,49.41 94.98,48.65 AT90USB1286.26
  Bottom 0.508: X1.3 v103.28,41.98
SRX1  (via drill 0.35)
  Top 0.508: v83.41,50.25 84.89,51.73 AT90USB1286.14 | v78,27 80.39,27 v81,27.61
  Bottom 0.508: v81,27.61 83.41,30.02 v83.41,50.25 | v78,27 34.68,27 34.68,29.87 34.05,30.5 20.47,30.5 19.84,29.87 19.84,21 19.84,20.5 19.84,18.94 SSERIAL1.1
SRX2  (via drill 0.35)
  Top 0.508: v84.39,25 86,26.61 v86,27.77 | v86.6,47 86.6,49.53 AT90USB1286.16
  Bottom 0.508: v86,27.77 86,29.86 86.73,30.59 86.73,46.88 v86.6,47 | v84.39,25 44.38,25 38.55,19.17 SSERIAL2.1
SS  (via drill 0.35)
  Top 0.508: v82,48 v85,48 | v84,54.97 85.97,54.97 AT90USB1286.10
  Bottom 0.508: RCS.1 61.19,59.16 61.19,53.81 ETHERNECHIP.9 65,48 v82,48 | v85,48 85,49.62 85.31,49.92 85.31,53.66 v84,54.97
STX1  (via drill 0.35)
  Top 0.508: v84.52,50.25 85.19,50.91 AT90USB1286.15 | v83,26 84,27 v84,27.61
  Bottom 0.508: v83,26 35.5,26 26.52,17.02 20.02,17.02 17,14 17,12.29 SSERIAL1.2 | v84,27.61 84,29.67 84.07,29.74 84.07,49.8 v84.52,50.25
STX2  (via drill 0.35)
  Top 0.508: v87.51,47 87.51,48.38 AT90USB1286.17 | v85,24 88,27 v88,27.61
  Bottom 0.508: v88,27.61 87.64,27.97 87.64,46.88 v87.51,47 | SSERIAL2.2 46.94,24 v85,24
T0  (via drill 0.35)
  Top 0.508: v105,52 104.73,51.73 104.38,51.73 104.33,51.78 103.67,51.78 103.62,51.73 AT90USB1286.35
  Bottom 0.508: v105,52 107.89,49.11 JP1.1
T1  (via drill 0.35)
  Top 0.508: AT90USB1286.36 v103,52.51
  Bottom 0.508: v103,52.51 104.4,52.51 104.67,52.78 110.86,52.78 JP1.2
T1IN  (via drill 0.35)
  Top 0.508: v99,47 98.64,47.36 96.81,47.36 96.42,47.75 AT90USB1286.28 | v77.39,28.5 85.62,28.5 85.67,28.55 92.44,28.55 v93,28
  Bottom 0.508: ICL3232.11 41.5,28.5 v77.39,28.5 | v99,47 99,43.88 105.77,37.11 108.02,37.11 111,34.12 111,32 108,29 107.56,28.55 107,28 v93,28
T1OUT
  Bottom 0.508: ICL3232.14 21.73,32.13 18.85,32.13 PRINTER.2
T2  (via drill 0.35)
  Top 0.508: AT90USB1286.37 103.97,53.33 v104,53.3
  Bottom 0.508: v104,53.3 104.25,53.3 104.4,53.45 111.25,53.45 JP1.3
T3  (via drill 0.35)
  Top 0.508: AT90USB1286.38 v103,54.11
  Bottom 0.508: v103,54.11 109.38,54.11 JP1.4
T4  (via drill 0.35)
  Top 0.508: AT90USB1286.39 103.93,54.93 v104,55
  Bottom 0.508: v104,55 107.73,55 JP1.5
T5  (via drill 0.35)
  Top 0.508: AT90USB1286.40 v103,55.71
  Bottom 0.508: JP1.6 105.9,55.71 104.4,55.71 104.33,55.78 103.67,55.78 103.6,55.71 v103,55.71
T6  (via drill 0.35)
  Top 0.508: AT90USB1286.41 103.96,56.53 v104,56.57
  Bottom 0.508: v104,56.57 111.78,64.35 JP1.7
T7  (via drill 0.35)
  Top 0.508: AT90USB1286.42 v103,57.31
  Bottom 0.508: v103,57.31 112,66.31 JP1.8
TPIN+
  Bottom 0.508: J1.1 15.35,53.83 15.43,53.9 16.54,53.9 16.62,53.83 24.48,53.83 RETH3.1 36.84,55 37.91,56.07 40.97,56.07 45.95,51.08 47.93,51.08 49.66,52.81 ETHERNECHIP.13
TPIN-
  Bottom 0.508: J1.2 16.54,52 RETH4.1 36.84,52 38.42,50.42 50.18,50.42 ETHERNECHIP.12
TPOUT+  (via drill 0.35)
  Top 0.508: v35,43 v45,43
  Bottom 0.508: J1.7 14.64,45.01 14.64,44.38 15.43,43.59 16.54,43.59 18.95,46 RETH2.1 28.65,43 v35,43 | v45,43 45.03,43 46.56,41.47 48.85,41.47 ETHERNECHIP.17
TPOUT-
  Bottom 0.508: J1.8 20.05,49 RETH1.1 36.84,49 37.91,47.93 38.79,47.93 39.86,49 46.22,49 ETHERNECHIP.16
TRIGGERBC  (via drill 0.35)
  Top 0.508: v74,74 v76,76 | v91,76 91,68.08 91.58,67.5 91.58,66.54 90.96,65.92 90.96,63.87 AT90USB1286.60
  Bottom 0.508: v74,74 56.41,91.58 24.59,91.58 20,87 14.45,87 BARCODE.3 | v76,76 v91,76
TXBC  (via drill 0.35)
  Top 0.508: AT90USB1286.27 95.66,48.5 95.76,48.4 95.76,47.47 96.54,46.7 97.46,46.7 v101.58,42.58
  Bottom 0.508: v101.58,42.58 102.22,43.22 104.33,43.22 104.78,43.67 104.78,45.33 94.12,55.99 94.12,68.27 95.59,69.74 95.59,70.62 94.96,71.25 91.77,71.25 88.88,74.14 75.97,74.14 57.11,93 24,93 19.18,88.17 BARCODE.2
XTAL1
  Top 0.508: Q1.2 93.22,47.36 AT90USB1286.24
  Bottom 0.508: Q1.2 96.04,44.54 CXTAL1.1
XTAL2
  Top 0.508: Q1.1 91.41,45.09 92.44,46.12 AT90USB1286.23
  Bottom 0.508: Q1.1 90.15,44.83 CXTAL2.1